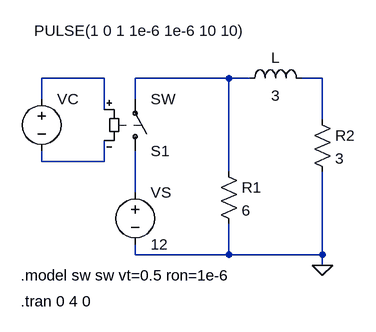
[diagram p0: schematic assig4_q1.asc]
assig4_q1.asc, the LTspice schematic file:
Version 4
SHEET 1 880 680
WIRE 192 112 96 112
WIRE 384 112 240 112
WIRE 416 112 384 112
WIRE 528 112 496 112
WIRE 96 144 96 112
WIRE 240 144 240 112
WIRE 192 160 192 112
WIRE 528 176 528 112
WIRE 96 240 96 224
WIRE 192 240 192 208
WIRE 192 240 96 240
WIRE 384 256 384 112
WIRE 240 288 240 224
WIRE 240 384 240 368
WIRE 384 384 384 336
WIRE 384 384 240 384
WIRE 528 384 528 256
WIRE 528 384 384 384
WIRE 528 400 528 384
FLAG 528 400 0
SYMBOL res 512 160 R0
SYMATTR InstName R2
SYMATTR Value 3
SYMBOL voltage 96 128 R0
WINDOW 3 -11 -89 Left 2
WINDOW 123 0 0 Left 0
WINDOW 39 0 0 Left 0
SYMATTR Value PULSE(1 0 1 1e-6 1e-6 10 10)
SYMATTR InstName VC
SYMBOL sw 240 240 M180
SYMATTR InstName S1
SYMBOL res 368 240 R0
SYMATTR InstName R1
SYMATTR Value 6
SYMBOL voltage 240 272 R0
SYMATTR InstName VS
SYMATTR Value 12
SYMBOL ind 400 128 R270
WINDOW 0 32 56 VTop 2
WINDOW 3 5 56 VBottom 2
SYMATTR InstName L
SYMATTR Value 3
TEXT 64 416 Left 2 !.model sw sw vt=0.5 ron=1e-6
TEXT 64 456 Left 2 !.tran 0 4 0

The netlist it stands for:
* assig4_q1.asc
R2 N003 0 3
VC N001 N004 PULSE(1 0 1 1e-6 1e-6 10 10)
S1 N005 N002 N001 N004 SW
R1 N002 0 6
VS N005 0 12
L N002 N003 3
.model sw sw vt=0.5 ron=1e-6
.tran 0 4 0
.backanno
.end